# EAGLE schematic RM_finish (EAGLE 9.5.2)
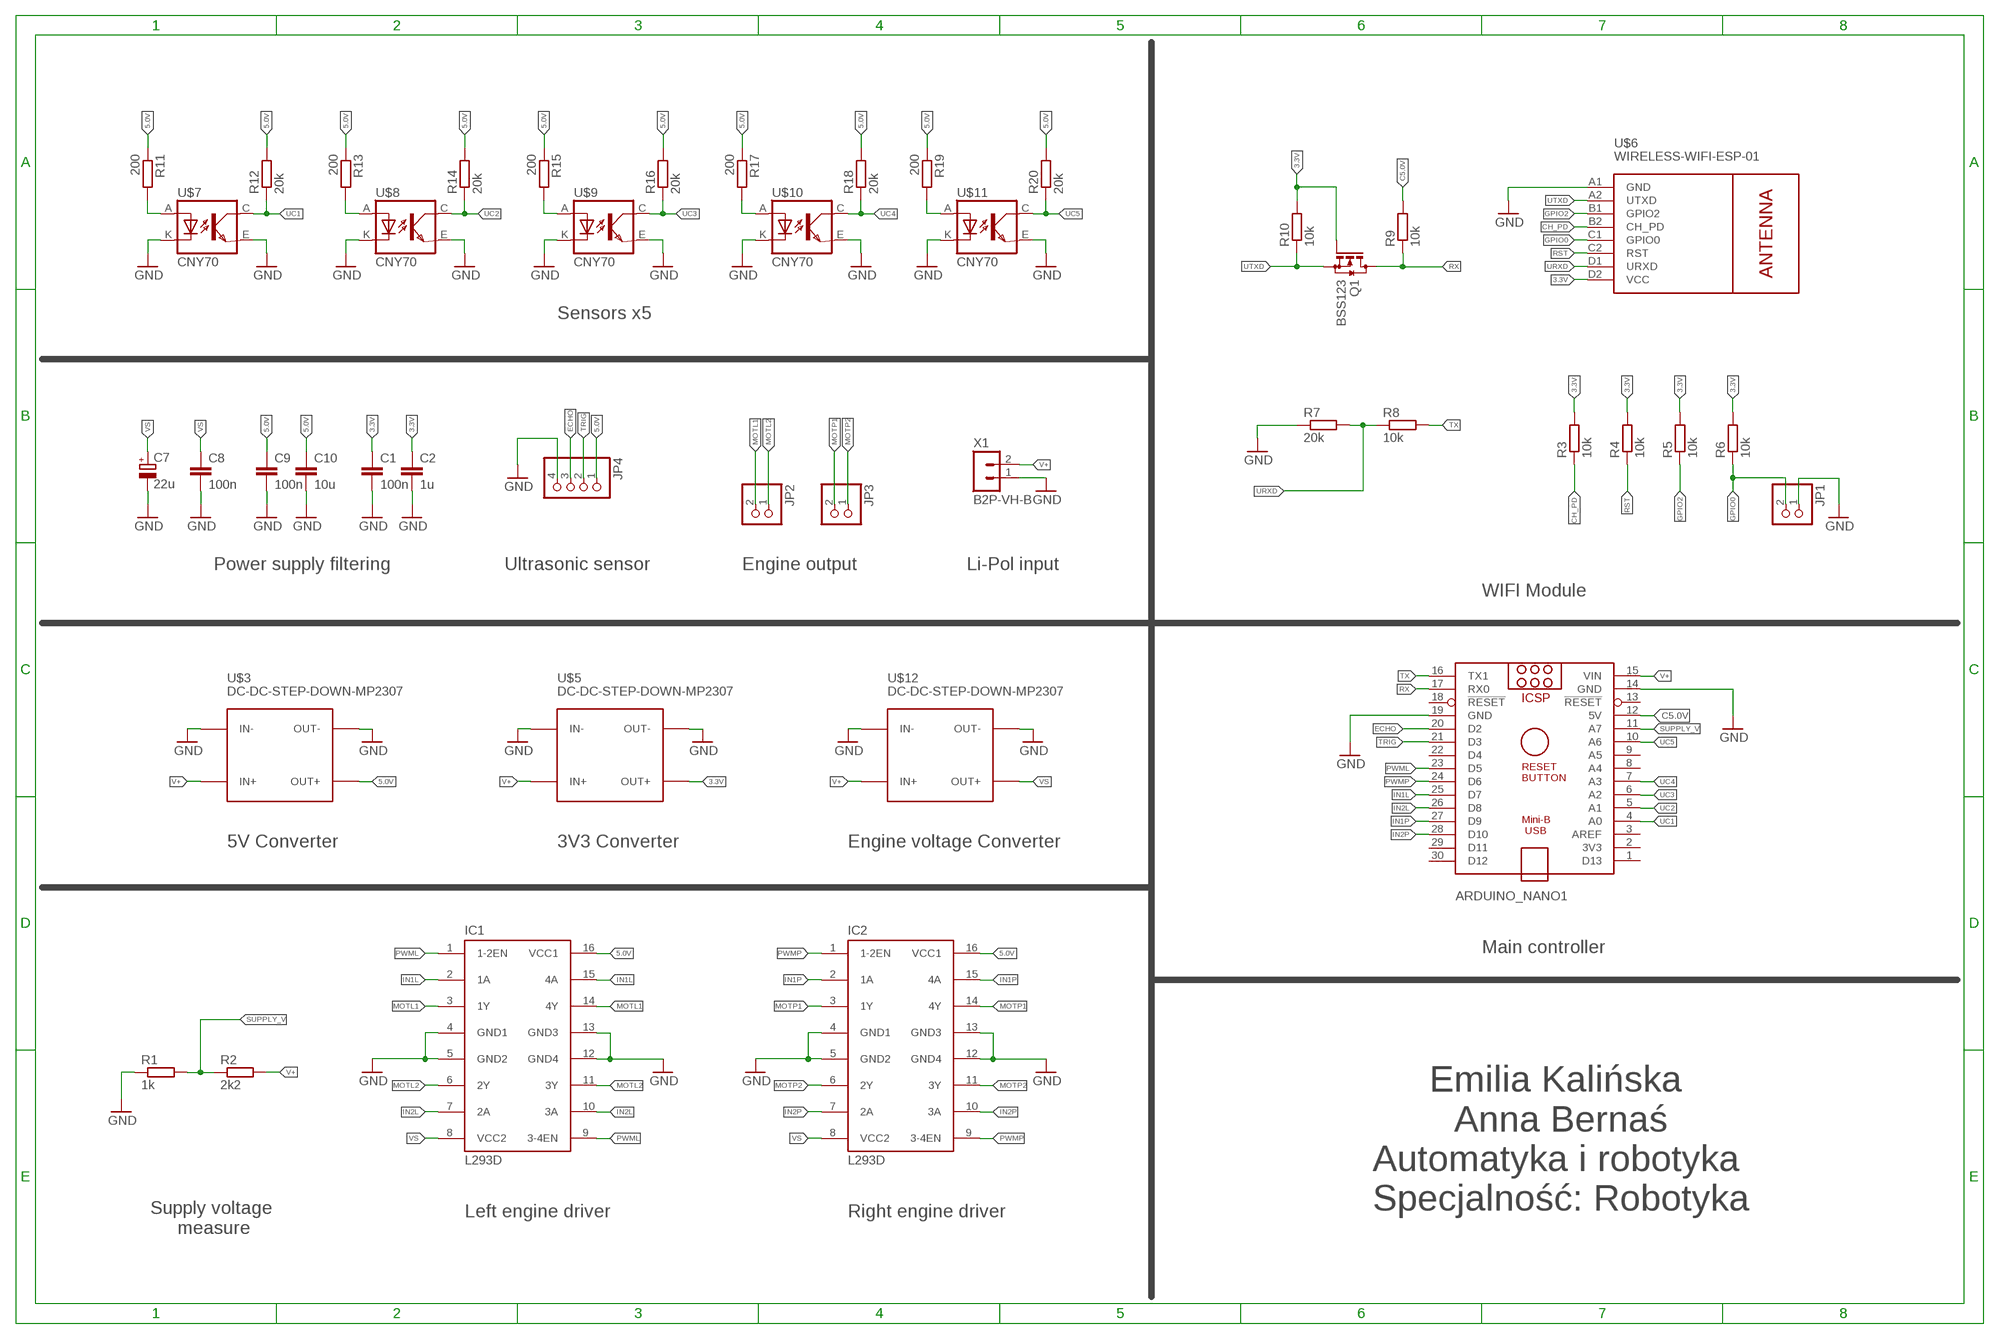
[diagram p0: schematic, sheet 1]

## Parts
ARDUINO_NANO1  ARDUINO_NANO  [ARDUINO_NANO]
C1  100n  C-EUC0805  [C0805]
C2  1u  C-EUC0805  [C0805]
C7  22u  CPOL-EU153CLV-0405  [153CLV-0405]
C8  100n  C-EUC0805  [C0805]
C9  100n  C-EUC0805  [C0805]
C10  10u  C-EUC0805  [C0805]
IC1  L293D  [DIL16]
IC2  L293D  [DIL16]
JP1  PINHD-1X2  [1X02]
JP2  PINHD-1X2  [1X02]
JP3  PINHD-1X2  [1X02]
JP4  PINHD-1X4  [1X04]
Q1  BSS123  [SOT23]
R1  1k  R-EU_R0805  [R0805]
R2  2k2  R-EU_R0805  [R0805]
R3  10k  R-EU_R0805  [R0805]
R4  10k  R-EU_R0805  [R0805]
R5  10k  R-EU_R0805  [R0805]
R6  10k  R-EU_R0805  [R0805]
R7  20k  R-EU_R0805  [R0805]
R8  10k  R-EU_R0805  [R0805]
R9  10k  R-EU_R0805  [R0805]
R10  10k  R-EU_R0805  [R0805]
R11  200  R-EU_R0805  [R0805]
R12  20k  R-EU_R0805  [R0805]
R13  200  R-EU_R0805  [R0805]
R14  20k  R-EU_R0805  [R0805]
R15  200  R-EU_R0805  [R0805]
R16  20k  R-EU_R0805  [R0805]
R17  200  R-EU_R0805  [R0805]
R18  20k  R-EU_R0805  [R0805]
R19  200  R-EU_R0805  [R0805]
R20  20k  R-EU_R0805  [R0805]
U$3  DC-DC-STEP-DOWN-MP2307  [DC-DC-STEP-DOWN-MP2307]
U$5  DC-DC-STEP-DOWN-MP2307  [DC-DC-STEP-DOWN-MP2307]
U$6  WIRELESS-WIFI-ESP-01  [WIRELESS-WIFI-ESP-01]
U$7  CNY70  [4]
U$8  CNY70  [4]
U$9  CNY70  [4]
U$10  CNY70  [4]
U$11  CNY70  [4]
U$12  DC-DC-STEP-DOWN-MP2307  [DC-DC-STEP-DOWN-MP2307]
X1  B2P-VH-B  [B2P-VH]

## Nets
3.3V: C1.1 C2.1 Q1.1(G) R3.2 R4.2 R5.2 R6.2 R10.2 U$5.OUT+ U$6.D2(VCC)
5.0V: C9.1 C10.1 IC1.16(VCC1) IC2.16(VCC1) JP4.1 R11.1 R12.2 R13.1 R14.2 R15.1 R16.2 R17.1 R18.2 R19.1 R20.2 U$3.OUT+
C5.0V: ARDUINO_NANO1.12(5V) R9.2
CH_PD: R3.1 U$6.B2(CH_PD)
ECHO: ARDUINO_NANO1.20(D2) JP4.3
GND: ARDUINO_NANO1.14(GND) ARDUINO_NANO1.19(GND) C1.2 C2.2 C7.- C8.2 C9.2 C10.2 IC1.4(GND1) IC1.5(GND2) IC1.12(GND4) IC1.13(GND3) IC2.4(GND1) IC2.5(GND2) IC2.12(GND4) IC2.13(GND3) JP1.1 JP4.4 R1.1 R7.1 U$3.IN- U$3.OUT- U$5.IN- U$5.OUT- U$6.A1(GND) U$7.E(EMI) U$7.K(C) U$8.E(EMI) U$8.K(C) U$9.E(EMI) U$9.K(C) U$10.E(EMI) U$10.K(C) U$11.E(EMI) U$11.K(C) U$12.IN- U$12.OUT- X1.1
GPIO0: JP1.2 R6.1 U$6.C1(GPIO0)
GPIO2: R5.1 U$6.B1(GPIO2)
IN1L: ARDUINO_NANO1.25(D7) IC1.2(1A) IC1.15(4A)
IN1P: ARDUINO_NANO1.27(D9) IC2.2(1A) IC2.15(4A)
IN2L: ARDUINO_NANO1.26(D8) IC1.7(2A) IC1.10(3A)
IN2P: ARDUINO_NANO1.28(D10) IC2.7(2A) IC2.10(3A)
MOTL1: IC1.3(1Y) IC1.14(4Y) JP2.2
MOTL2: IC1.6(2Y) IC1.11(3Y) JP2.1
MOTP1: IC2.3(1Y) IC2.14(4Y) JP3.2
MOTP2: IC2.6(2Y) IC2.11(3Y) JP3.1
N$2: R11.2 U$7.A
N$3: R13.2 U$8.A
N$4: R15.2 U$9.A
N$5: R17.2 U$10.A
N$6: R19.2 U$11.A
PWML: ARDUINO_NANO1.23(D5) IC1.1(1-2EN) IC1.9(3-4EN)
PWMP: ARDUINO_NANO1.24(D6) IC2.1(1-2EN) IC2.9(3-4EN)
RST: R4.1 U$6.C2(RST)
RX: ARDUINO_NANO1.17(RX0) Q1.3(D) R9.1
SUPPLY_V: ARDUINO_NANO1.11(A7) R1.2 R2.1
TRIG: ARDUINO_NANO1.21(D3) JP4.2
TX: ARDUINO_NANO1.16(TX1) R8.2
UC1: ARDUINO_NANO1.4(A0) R12.1 U$7.C(COL)
UC2: ARDUINO_NANO1.5(A1) R14.1 U$8.C(COL)
UC3: ARDUINO_NANO1.6(A2) R16.1 U$9.C(COL)
UC4: ARDUINO_NANO1.7(A3) R18.1 U$10.C(COL)
UC5: ARDUINO_NANO1.10(A6) R20.1 U$11.C(COL)
URXD: R7.2 R8.1 U$6.D1(URXD)
UTXD: Q1.2(S) R10.1 U$6.A2(UTXD)
V+: ARDUINO_NANO1.15(VIN) R2.2 U$3.IN+ U$5.IN+ U$12.IN+ X1.2
VS: C7.+ C8.1 IC1.8(VCC2) IC2.8(VCC2) U$12.OUT+
Unconnected: ARDUINO_NANO1.1(D13) ARDUINO_NANO1.2(3V3) ARDUINO_NANO1.3(AREF) ARDUINO_NANO1.8(A4) ARDUINO_NANO1.9(A5) ARDUINO_NANO1.13(!RESET) ARDUINO_NANO1.18(!RESET) ARDUINO_NANO1.22(D4) ARDUINO_NANO1.29(D11) ARDUINO_NANO1.30(D12)

## Notes on the sheet
- Sensors x5
- Power supply filtering | Ultrasonic sensor | Engine output | Li-Pol input
- WIFI Module
- 5V Converter | 3V3 Converter | Engine voltage Converter
- Main controller
- Emilia Kalińska 
  Anna Bernaś
  Automatyka i robotyka 
  Specjalność: Robotyka
- Supply voltage 
  measure
- Left engine driver | Right engine driver

## Library data of the parts
ARDUINO_NANO1 = ArduinoNanoV30:ARDUINO_NANO: Arduino Nano V3.0 Overview: The Arduino Nano is a small, complete, and breadboard-friendly board based on the ATmega328 (Arduino Nano 3.x) or ATmega168 (Arduino Nano 2.x). It has more or less the same functionality of the Arduino Duemilanove, but in a different package. It lacks only a DC power jack, and works with a Mini-B USB cable instead of a standard one. The Nano was designed and is being produced by Gravitech. Specifications: Microcontroller Atmel ATmega168 or ATmega328 Operating Voltage (logic level) 5 V Input Voltage (recommended) 7-12 V Input Voltage (limits) 6-20 V Digital I/O Pins 14 (of which 6 provide PWM output) Analog Input Pins 8 DC Current per I/O Pin 40 mA Flash Memory 16 KB (ATmega168) or 32 KB (ATmega328) of which 2 KB used by bootloader SRAM 1 KB (ATmega168) or 2 KB (ATmega328) EEPROM 512 bytes (ATmega168) or 1 KB (ATmega328) Clock Speed 16 MHz Dimensions 0.73" x 1.70" Length 45 mm Width 18 mm Weigth 5 g Power: The Arduino Nano can be powered via the Mini-B USB connection, 6-20V unregulated external power supply (pin 30), or 5V regulated external power supply (pin 27). The power source is automatically selected to the highest voltage source. Memory: The ATmega168 has 16 KB of flash memory for storing code (of which 2 KB is used for the bootloader); the ATmega328 has 32 KB, (also with 2 KB used for the bootloader). The ATmega168 has 1 KB of SRAM and 512 bytes of EEPROM (which can be read and written with the EEPROM library); the ATmega328 has 2 KB of SRAM and 1 KB of EEPROM. Input and Output: Each of the 14 digital pins on the Nano can be used as an input or output, using pinMode(), digitalWrite(), and digitalRead() functions. They operate at 5 volts. Each pin can provide or receive a maximum of 40 mA and has an internal pull-up resistor (disconnected by default) of 20-50 kOhms. In addition, some pins have specialized functions. Visit Arduino - ArduinoBoardNano <https://www.arduino.cc/en/Main/ArduinoBoardNano>
C1 C2 C8-C10 = rcl:C-EU: CAPACITOR, European symbol; SPICEPREFIX: C
C7 = rcl:CPOL-EU: POLARIZED CAPACITOR, European symbol; SPICEPREFIX: C
IC1 IC2 = st-microelectronics:L293D: PUSH-PULL 4 CHANNEL DRIVER; MPN: L293D; OC_FARNELL: 9589619; OC_NEWARK: 56P8249
JP1-JP3 = pinhead:PINHD-1X2: PIN HEADER
JP4 = pinhead:PINHD-1X4: PIN HEADER
Q1 = transistor-small-signal:BSS123: N-CHANNEL MOS FET
R1-R20 = rcl:R-EU_: RESISTOR, European symbol; SPICEPREFIX: R
U$3 U$5 U$12 = diy-modules (1):DC-DC-STEP-DOWN-MP2307: DC/DC Step-Down Regulator based on MP2307DN chip MP2307 datasheet available here: https://cdn-shop.adafruit.com/datasheets/MP2307_r1.9.pdf Click here to find device on ebay.com <http://www.ebay.com/sch/dc+dc+3a+mini+converter>
U$6 = diy-modules:WIRELESS-WIFI-ESP-01: Wireless Wi-Fi ESP-01 Module based on ESP8266 chip Click here to find device on ebay.com <http://www.ebay.com/sch/esp8266+esp+01+transceiver>
U$7-U$11 = cny70:CNY70
X1 = con-JST VH:B2P-VH: JST VH Series header 3.96mm pitch disconnectable crimp style connectors, vertical (side entry type), 2 pins